# Altium schematic sheet tree.SchDoc
size A4
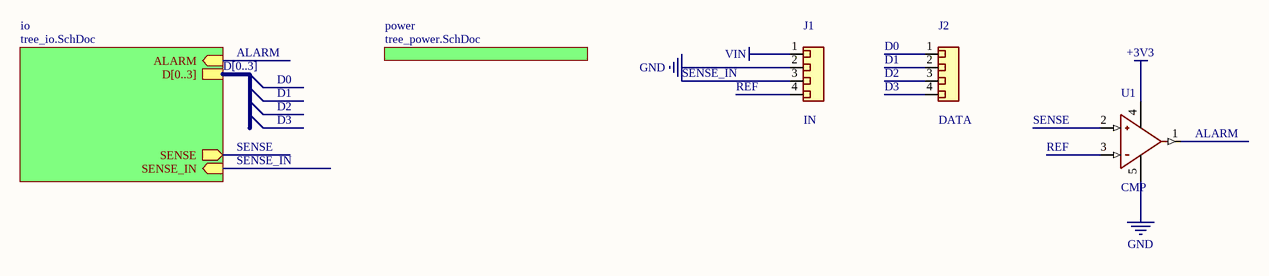
[diagram p0: tree.SchDoc]

## Parts
J1  IN  [HDR1X4]
J2  DATA  [HDR1X4]
U1  CMP  [SOT23-5]

## Sub-sheets
io = tree_io.SchDoc: ALARM (in), D[0..3], SENSE (out), SENSE_IN (in)
power = tree_power.SchDoc: no entries

## Nets
+3V3: U1.4(V+)
GND: J1.2(Passive) U1.5(V-)
VIN: J1.1(Passive)
ALARM: U1.1 ; sheet io/ALARM
D0: J2.1(Passive)
D1: J2.2(Passive)
D2: J2.3(Passive)
D3: J2.4(Passive)
REF: J1.4(Passive) U1.3(-)
SENSE: U1.2(+) ; sheet io/SENSE
SENSE_IN: J1.3(Passive) ; sheet io/SENSE_IN

## Buses and harness runs
bus D[0..3] = sheet io/D[0..3]

## Library data of the parts
J1 J2 = Connector_4
U1 = Comparator